# EAGLE design display300 (EAGLE 4.15)
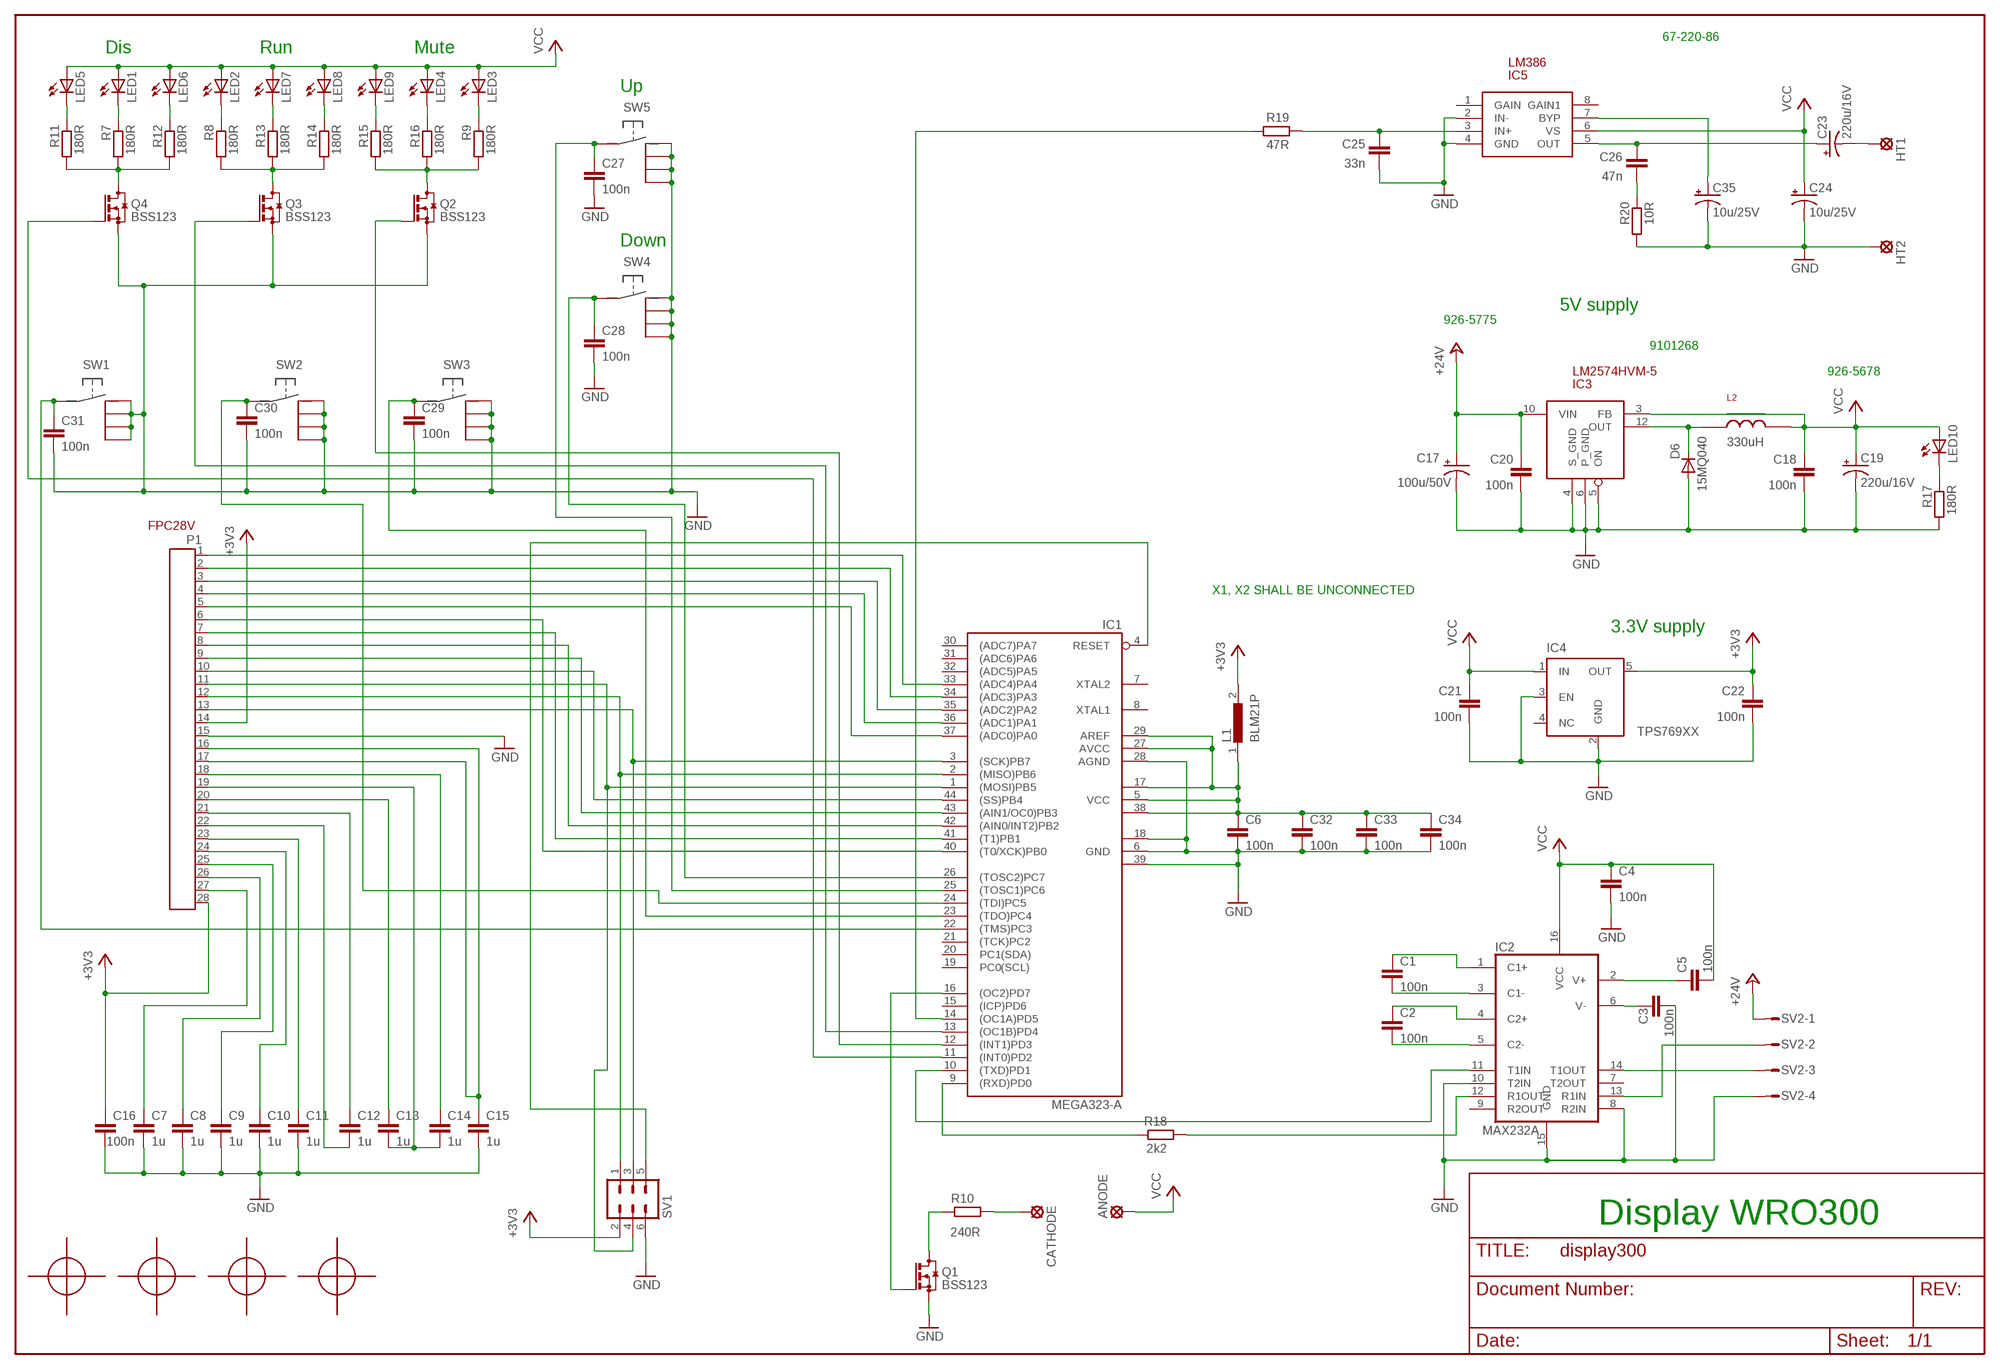
[diagram p0: schematic, sheet 1]

## Parts
ANODE  LSP13  [LSP13]
C1  100n  C-EUC0805K  [C0805K]
C2  100n  C-EUC0805K  [C0805K]
C3  100n  C-EUC0805K  [C0805K]
C4  100n  C-EUC0805K  [C0805K]
C5  100n  C-EUC0805K  [C0805K]
C6  100n  C-EUC0805K  [C0805K]
C7  1u  C-EUC0805K  [C0805K]
C8  1u  C-EUC0805K  [C0805K]
C9  1u  C-EUC0805K  [C0805K]
C10  1u  C-EUC0805K  [C0805K]
C11  1u  C-EUC0805K  [C0805K]
C12  1u  C-EUC0805K  [C0805K]
C13  1u  C-EUC0805K  [C0805K]
C14  1u  C-EUC0805K  [C0805K]
C15  1u  C-EUC0805K  [C0805K]
C16  100n  C-EUC0805K  [C0805K]
C17  100u/50V  CPOL-USE  [PANASONIC_E]
C18  100n  C-EUC0805K  [C0805K]
C19  220u/16V  CPOL-USD  [PANASONIC_D]
C20  100n  C-EUC0805K  [C0805K]
C21  100n  C-EUC0805K  [C0805K]
C22  100n  C-EUC0805K  [C0805K]
C23  220u/16V  CPOL-USD  [PANASONIC_D]
C24  10u/25V  CPOL-USB  [PANASONIC_B]
C25  33n  C-EUC0805K  [C0805K]
C26  47n  C-EUC0805K  [C0805K]
C27  100n  C-EUC0805K  [C0805K]
C28  100n  C-EUC0805K  [C0805K]
C29  100n  C-EUC0805K  [C0805K]
C30  100n  C-EUC0805K  [C0805K]
C31  100n  C-EUC0805K  [C0805K]
C32  100n  C-EUC0805K  [C0805K]
C33  100n  C-EUC0805K  [C0805K]
C34  100n  C-EUC0805K  [C0805K]
C35  10u/25V  CPOL-USB  [PANASONIC_B]
CATHODE  LSP13  [LSP13]
D6  15MQ040  DIODE-SMB  [SMB]
HT1  LSP10  [LSP10]
HT2  LSP10  [LSP10]
IC1  MEGA323-A  [TQFP44]
IC2  MAX232A  [SO16]
IC3  LM2574HVM-5  [SO14W]
IC4  TPS769XX  [SOT23-5]
IC5  LM386  [SO8]
L1  BLM21P  L1210  [C1210]
L2  330uH  IND_KOA_330U  [IND_KOA_330U]
LED1  LEDSMT1206  [1206]
LED2  LEDSMT1206  [1206]
LED3  LEDSMT1206  [1206]
LED4  LEDSMT1206  [1206]
LED5  LEDSMT1206  [1206]
LED6  LEDSMT1206  [1206]
LED7  LEDSMT1206  [1206]
LED8  LEDSMT1206  [1206]
LED9  LEDSMT1206  [1206]
LED10  LEDSMT1206  [1206]
P1  FPC28V  [FPC28V]
Q1  BSS123  [SOT23]
Q2  BSS123  [SOT23]
Q3  BSS123  [SOT23]
Q4  BSS123  [SOT23]
R7  180R  R-EU_M0805  [M0805]
R8  180R  R-EU_M0805  [M0805]
R9  180R  R-EU_M0805  [M0805]
R10  240R  R-EU_M0805  [M0805]
R11  180R  R-EU_M0805  [M0805]
R12  180R  R-EU_M0805  [M0805]
R13  180R  R-EU_M0805  [M0805]
R14  180R  R-EU_M0805  [M0805]
R15  180R  R-EU_M0805  [M0805]
R16  180R  R-EU_M0805  [M0805]
R17  180R  R-EU_M0805  [M0805]
R18  2k2  R-EU_M0805  [M0805]
R19  47R  R-EU_M0805  [M0805]
R20  10R  R-EU_R0805W  [R0805W]
SV1  MA03-2  [MA03-2]
SV2  S04P  [S04P]
SW1  GPV_PUSH  [GPV_PUSH]
SW2  GPV_PUSH  [GPV_PUSH]
SW3  GPV_PUSH  [GPV_PUSH]
SW4  GPV_PUSH  [GPV_PUSH]
SW5  GPV_PUSH  [GPV_PUSH]
U$1  FEDUSIAL_1MM  [FEDUSIAL_1MM]
U$2  FEDUSIAL_1MM  [FEDUSIAL_1MM]
U$3  FEDUSIAL_1MM  [FEDUSIAL_1MM]
U$4  FEDUSIAL_1MM  [FEDUSIAL_1MM]

## Nets
+3V3: C16.1 C22.2 IC4.5(OUT) L1.2 P1.14 P1.28 SV1.2
+24V: C17.+ C20.2 IC3.10(VIN) SV2.1
GND: C3.2 C4.2 C6.2 C7.2 C8.2 C9.2 C10.2 C11.2 C15.2 C16.2 C17.- C18.1 C19.- C20.1 C21.1 C22.1 C24.- C25.1 C27.2 C28.2 C29.2 C30.2 C31.2 C32.2 C33.2 C34.2 C35.- D6.A HT2.MP IC1.6(GND) IC1.18(GND1) IC1.28(AGND) IC1.39(GND2) IC2.8(R2IN) IC2.10(T2IN) IC2.15(GND) IC3.4(S_GND) IC3.5(ON) IC3.6(P_GND) IC4.2(GND) IC4.3(EN) IC5.2(IN-) IC5.4(GND) P1.15 Q1.2(S) Q2.2(S) Q3.2(S) Q4.2(S) R17.2 R20.2 SV1.6 SV2.4 SW1.P$2 SW1.P$3 SW1.P$4 SW1.P$5 SW2.P$2 SW2.P$3 SW2.P$4 SW2.P$5 SW3.P$2 SW3.P$3 SW3.P$4 SW3.P$5 SW4.P$2 SW4.P$3 SW4.P$4 SW4.P$5 SW5.P$2 SW5.P$3 SW5.P$4 SW5.P$5
N$1: IC1.40((T0/XCK)PB0) P1.6
N$2: IC1.41((T1)PB1) P1.7
N$3: IC1.42((AIN0/INT2)PB2) P1.8
N$4: IC1.43((AIN1/OC0)PB3) P1.9
N$5: IC1.44((SS)PB4) P1.10
N$6: IC1.1((MOSI)PB5) P1.11 SV1.4
N$7: IC1.2((MISO)PB6) P1.12 SV1.1
N$8: IC1.3((SCK)PB7) P1.13 SV1.3
N$9: IC1.37((ADC0)PA0) P1.5
N$10: IC1.36((ADC1)PA1) P1.4
N$11: IC1.35((ADC2)PA2) P1.3
N$12: IC1.34((ADC3)PA3) P1.2
N$13: IC1.33((ADC4)PA4) P1.1
N$14: C15.1 P1.16 P1.17
N$15: C27.1 IC1.25((TOSC1)PC6) SW5.P$1
N$16: C14.1 P1.18
N$17: C13.2 C14.2 P1.19
N$18: C13.1 P1.20
N$19: C12.1 P1.21
N$20: C12.2 P1.22
N$21: C11.1 P1.23
N$22: C10.1 P1.24
N$23: C9.1 P1.25
N$24: C8.1 P1.26
N$25: C7.1 P1.27
N$26: C35.+ IC5.7(BYP)
N$27: LED3.C R9.1
N$28: C6.1 C32.1 C33.1 C34.1 IC1.5(VCC) IC1.17(VCC1) IC1.27(AVCC) IC1.29(AREF) IC1.38(VCC2) L1.1
N$29: LED2.C R8.1
N$30: LED1.C R7.1
N$31: IC2.14(T1OUT) SV2.3
N$32: IC1.11((INT0)PD2) Q4.1(G)
N$33: IC2.13(R1IN) SV2.2
N$34: IC1.10((TXD)PD1) IC2.11(T1IN)
N$35: IC1.9((RXD)PD0) R18.2
N$36: C2.2 IC2.5(C2-)
N$37: C2.1 IC2.4(C2+)
N$38: C1.2 IC2.3(C1-)
N$39: C1.1 IC2.1(C1+)
N$40: C5.1 IC2.2(V+)
N$41: C3.1 IC2.6(V-)
N$42: IC1.13((OC1B)PD4) Q3.1(G)
N$43: IC1.4(RESET) SV1.5
N$44: IC1.12((INT1)PD3) Q2.1(G)
N$45: LED5.C R11.1
N$46: Q1.3(D) R10.2
N$47: LED6.C R12.1
N$48: LED7.C R13.1
N$49: Q4.3(D) R7.2 R11.2 R12.2
N$50: Q3.3(D) R8.2 R13.2 R14.2
N$51: CATHODE.MP R10.1
N$52: D6.C IC3.12(OUT) L2.P$1
N$53: Q2.3(D) R9.2 R15.2 R16.2
N$54: IC1.16((OC2)PD7) Q1.1(G)
N$55: LED10.C R17.1
N$56: LED8.C R14.1
N$57: LED9.C R15.1
N$58: LED4.C R16.1
N$59: IC2.12(R1OUT) R18.1
N$60: C23.+ C26.2 IC5.5(OUT)
N$61: C26.1 R20.1
N$63: C23.- HT1.MP
N$64: C25.2 IC5.3(IN+) R19.1
N$65: IC1.14((OC1A)PD5) R19.2
N$68: C28.1 IC1.26((TOSC2)PC7) SW4.P$1
N$71: C31.1 IC1.22((TMS)PC3) SW1.P$1
N$72: C30.1 IC1.24((TDI)PC5) SW2.P$1
N$73: C29.1 IC1.23((TDO)PC4) SW3.P$1
VCC: ANODE.MP C4.1 C5.2 C18.2 C19.+ C21.2 C24.+ IC2.16(VCC) IC3.3(FB) IC4.1(IN) IC5.6(VS) L2.P$4 LED1.A LED2.A LED3.A LED4.A LED5.A LED6.A LED7.A LED8.A LED9.A LED10.A
Unconnected: IC1.7(XTAL2) IC1.8(XTAL1) IC1.15((ICP)PD6) IC1.19(PC0(SCL)) IC1.20(PC1(SDA)) IC1.21((TCK)PC2) IC1.30((ADC7)PA7) IC1.31((ADC6)PA6) IC1.32((ADC5)PA5) IC2.7(T2OUT) IC2.9(R2OUT) IC4.4(NC) IC5.1(GAIN) IC5.8(GAIN1)

## Notes on the sheet
- 67-220-86
- Dis | Run | Mute
- Up
- Down
- 5V supply
- 926-5775
- 9101268
- 926-5678
- X1, X2 SHALL BE UNCONNECTED
- 3.3V supply
- Display WRO300

## Library data of the parts
ANODE CATHODE = solpad:LSP13: SOLDER PAD drill 1.3 mm, distributor Buerklin, 12H562
C1-C16 C18 C20-C22 C25-C34 = rcl:C-EU: CAPACITOR, European symbol
C17 C19 C23 C24 C35 = rcl:CPOL-US: POLARIZED CAPACITOR, American symbol
D6 = diode:DIODE-: DIODE
HT1 HT2 = solpad:LSP10: SOLDER PAD drill 1.0 mm, distributor Buerklin, 12H555
IC1 = avr:MEGA323: MICROCONTROLLER 32 Kbytes FLASH 2 Kbytes SRAM 1 Kbytes EEPROM USART 8-channel 10 bit ADC
IC2 = lbm:MAX232A
IC3 = lbm:LM2574
IC4 = lbm:TPS769XX
IC5 = lbm:LM386
L1 = lbm:L1210
L2 = lbm:IND_KOA_330U
LED1-LED10 = led:LED: LED OSRAM: - CHIPLED LG R971, LG N971, LY N971, LG Q971, LY Q971, LO R971, LY R971 LH N974, LH R974 LS Q976, LO Q976, LY Q976 LO Q996 - Hyper CHIPLED LW Q18S LB Q993, LB Q99A, LB R99A - SideLED LS A670, LO A670, LY A670, LG A670, LP A670 LB A673, LV A673, LT A673, LW A673 LH A674 LY A675 LS A676, LA A676, LO A676, LY A676, LW A676 LS A679, LY A679, LG A679 - Hyper Micro SIDELED® LS Y876, LA Y876, LO Y876, LY Y876 LT Y87S - SmartLED LW L88C, LW L88S LB L89C, LB L89S, LG L890 LS L89K, LO L89K, LY L89K LS L896, LA L896, LO L896, LY L896 - TOPLED LS T670, LO T670, LY T670, LG T670, LP T670 LSG T670, LSP T670, LSY T670, LOP T670, LYG T670 LG T671, LOG T671, LSG T671 LB T673, LV T673, LT T673, LW T673 LH T674 LS T676, LA T676, LO T676, LY T676, LB T676, LH T676, LSB T676, LW T676 LB T67C, LV T67C, LT T67C, LS T67K, LO T67K, LY T67K, LW E67C LS E67B, LA E67B, LO E67B, LY E67B, LB E67C, LV E67C, LT E67C LW T67C LS T679, LY T679, LG T679 LS T770, LO T770, LY T770, LG T770, LP T770 LB T773, LV T773, LT T773, LW T773 LH T774 LS E675, LA E675, LY E675, LS T675 LS T776, LA T776, LO T776, LY T776, LB T776 LHGB T686 LT T68C, LB T68C - Hyper Mini TOPLED® LB M676 - Mini TOPLED Santana® LG M470 LS M47K, LO M47K, LY M47K Source: http://www.osram.convergy.de/
P1 = lbm:FPC28V
Q1-Q4 = transistor-small-signal:BSS123: N-CHANNEL MOS FET
R7-R20 = rcl:R-EU_: RESISTOR, European symbol
SV1 = con-lstb:MA03-2: PIN HEADER
SV2 = con-amp-mt:S04P: AMP MT CONNECTOR
SW1-SW5 = lbm:GPV_PUSH
U$1-U$4 = lbm:FEDUSIAL_1MM

## Board
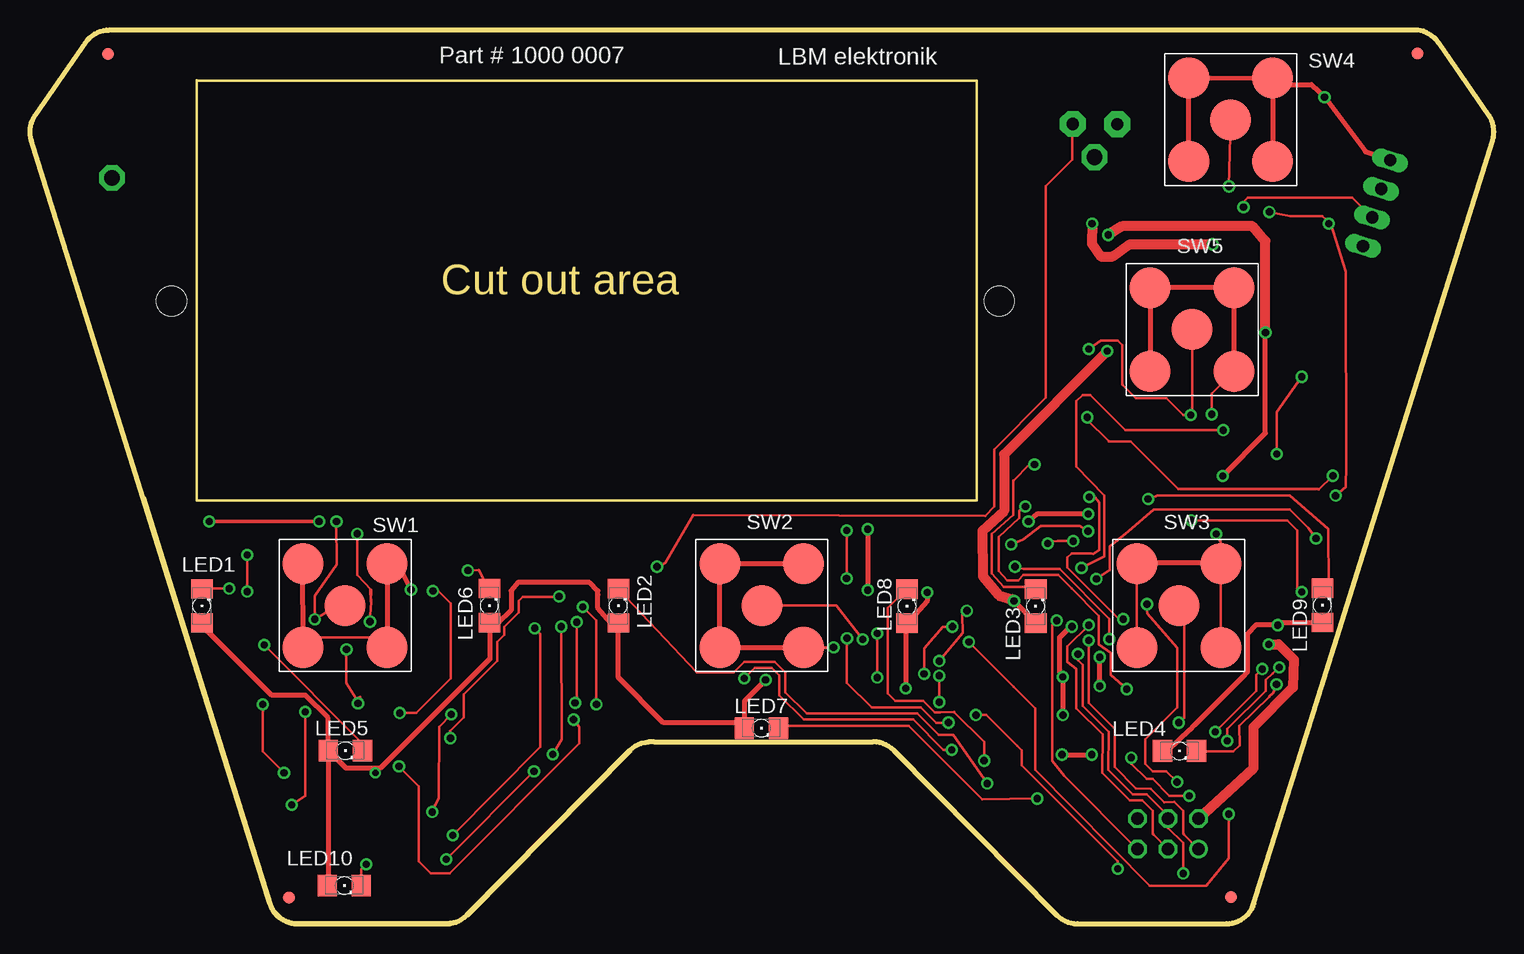
[diagram p1: board, top side]
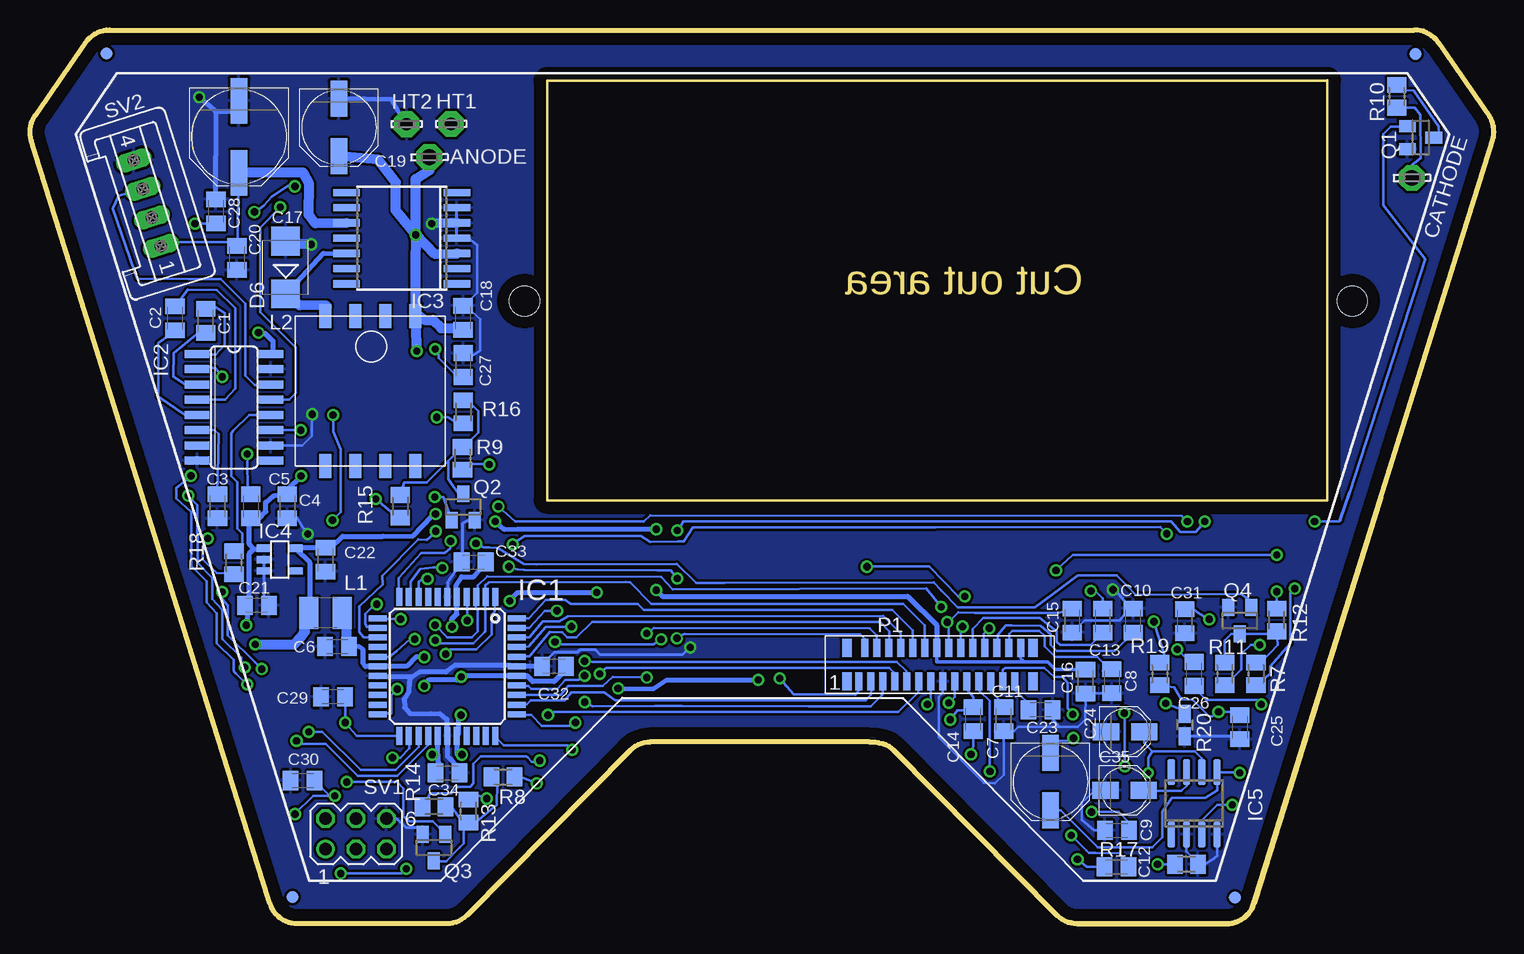
[diagram p2: board, bottom side, seen from below]

Size 121.99 x 74.52 mm. Coordinates in mm from the lower left corner, seen from the top.
Outline: 115.37,74.51 115.63,74.5 115.88,74.46 116.13,74.39 116.37,74.3 116.6,74.18 116.81,74.03 117.01,73.87 117.19,73.68 117.34,73.48 121.56,67.39 121.69,67.18 121.8,66.97 121.88,66.74 121.94,66.5 121.98,66.26 121.99,66.02 121.98,65.78 121.94,65.54 121.88,65.31 102,1.68 101.91,1.45 101.79,1.22 101.66,1.01 101.5,0.81 101.32,0.63 101.12,0.47 100.91,0.33 100.69,0.21 100.45,0.12 100.21,0.05 99.96,0.01 99.7,0 87.28,0 87.01,0.01 86.74,0.06 86.48,0.14 86.23,0.24 85.99,0.37 85.77,0.53 85.57,0.71 71.98,14.46 71.78,14.64 71.56,14.8 71.32,14.93 71.07,15.03 70.81,15.11 70.55,15.15 70.27,15.17 52.03,15.15 51.55,15.14 51.28,15.1 50.91,15.03 50.66,14.93 50.42,14.8 50.2,14.64 50,14.46 36.41,0.71 36.21,0.53 35.99,0.37 35.75,0.24 35.5,0.14 35.24,0.06 34.97,0.01 34.7,0 22.28,0 22.02,0.01 21.77,0.05 21.53,0.12 21.29,0.21 21.07,0.33 20.86,0.47 20.66,0.63 20.48,0.81 20.32,1.01 20.19,1.22 20.08,1.45 19.99,1.68 9.43,35.52
Outline: 115.66,74.51 6.62,74.52 6.36,74.5 6.11,74.46 5.86,74.39 5.62,74.3 5.39,74.18 5.18,74.04 4.98,73.87 4.8,73.69 4.65,73.48 0.43,67.39 0.3,67.19 0.19,66.97 0.11,66.74 0.05,66.5 0.01,66.27 0,66.03 0.01,65.78 0.05,65.54 0.11,65.31 19.99,1.69 20.08,1.45 20.2,1.22 20.33,1.01 20.49,0.81 20.67,0.63 20.87,0.47 21.08,0.33 21.3,0.21 21.54,0.12 21.78,0.06 22.03,0.01 22.29,0 34.71,0 34.98,0.02 35.25,0.06 35.51,0.14 35.76,0.24 36,0.38 36.22,0.53 36.42,0.72 50.01,14.46
Outline: 13.88,70.29 78.9,70.29 78.9,35.31 13.88,35.31 13.88,70.31
Copper layers (1*16): Top 0.035mm / dielectric 1.5mm / Bottom 0.035mm
Design rules "default": minimum track width 8mil, minimum drill 20mil, track to track 8mil, track to pad 8mil, pad to pad 7mil, via to via 8mil, smd to smd 8mil, copper to edge 40mil, drill to drill 8mil, minimum pad ring 10mil, minimum via ring 8mil, stop-mask expansion 4mil, vias tented up to drill 0mil, thermal gap 10mil
Holes 2.5 mm at 80.78,51.92 11.79,51.92

### Footprints (pad centres in the part's own frame; a part is rotated, then mirrored left to right if it is on the bottom)
LSP13 = drill 1.321 pad 2.159 octagon: MP 0,0
C0805K = smd 1.3 x 1.6: 1 -1,0; 2 1,0
PANASONIC_E = smd 3.8 x 1.4: + 3,0; - -3,0
PANASONIC_D = smd 3 x 1.4: + 2.4,0; - -2.4,0
PANASONIC_B = smd 2.2 x 1.4: + 1.6,0; - -1.6,0
SMB = smd 2.4 x 2.4: A 2.2,0; C -2.2,0
LSP10 = drill 1.016 pad 2.159 octagon: MP 0,0
TQFP44 = smd 1.5 x 0.5: 1 -5.8,4; 2 -5.8,3.2; 3 -5.8,2.4; 4 -5.8,1.6; 5 -5.8,0.8; 6 -5.8,0; 7 -5.8,-0.8; 8 -5.8,-1.6; 9 -5.8,-2.4; 10 -5.8,-3.2; 11 -5.8,-4; 23 5.8,-4; 24 5.8,-3.2; 25 5.8,-2.4; 26 5.8,-1.6; 27 5.8,-0.8; 28 5.8,0; 29 5.8,0.8; 30 5.8,1.6; 31 5.8,2.4; 32 5.8,3.2; 33 5.8,4 | smd 0.5 x 1.5: 12 -4,-5.8; 13 -3.2,-5.8; 14 -2.4,-5.8; 15 -1.6,-5.8; 16 -0.8,-5.8; 17 0,-5.8; 18 0.8,-5.8; 19 1.6,-5.8; 20 2.4,-5.8; 21 3.2,-5.8; 22 4,-5.8; 34 4,5.8; 35 3.2,5.8; 36 2.4,5.8; 37 1.6,5.8; 38 0.8,5.8; 39 0,5.8; 40 -0.8,5.8; 41 -1.6,5.8; 42 -2.4,5.8; 43 -3.2,5.8; 44 -4,5.8
SO16 = smd 0.66 x 2.032: 1 -4.445,-3.073; 2 -3.175,-3.073; 3 -1.905,-3.073; 4 -0.635,-3.073; 5 0.635,-3.073; 6 1.905,-3.073; 7 3.175,-3.073; 8 4.445,-3.073; 9 4.445,3.073; 10 3.175,3.073; 11 1.905,3.073; 12 0.635,3.073; 13 -0.635,3.073; 14 -1.905,3.073; 15 -3.175,3.073; 16 -4.445,3.073
SO14W = smd 0.6 x 2.2: 1 -3.81,-4.6; 2 -2.54,-4.6; 3 -1.27,-4.6; 4 0,-4.6; 5 1.27,-4.6; 6 2.54,-4.6; 7 3.81,-4.6; 8 3.81,4.6; 9 2.54,4.6; 10 1.27,4.6; 11 0,4.6; 12 -1.27,4.6; 13 -2.54,4.6; 14 -3.81,4.6
SOT23-5 = smd 0.6 x 1.2: 1 -0.95,-1.306; 2 0,-1.306; 3 0.95,-1.306; 4 0.95,1.306; 5 -0.95,1.306
SO8 = smd 0.6 x 2.2: 1 -1.905,-2.6; 2 -0.635,-2.6; 3 0.635,-2.6; 4 1.905,-2.6; 5 1.905,2.6; 6 0.635,2.6; 7 -0.635,2.6; 8 -1.905,2.6
C1210 = smd 1.6 x 2.7: 1 -2.67,2.54; 2 0.13,2.54
IND_KOA_330U = smd 2 x 1: P$1 0,0; P$2 0,2.5; P$3 0,5; P$4 0,7.5; P$5 12.5,0; P$6 12.5,2.5; P$7 12.5,5; P$8 12.5,7.5
1206 = smd 1.6 x 1.803: A -1.422,0; C 1.422,0
FPC28V = smd 0.6 x 1.5: 1 0,0; 2 0.5,2.8; 3 1,0; 4 1.5,2.8; 5 2,0; 6 2.5,2.8; 7 3,0; 8 3.5,2.8; 9 4,0; 10 4.5,2.8; 11 5,0; 12 5.5,2.8; 13 6,0; 14 6.5,2.8; 15 7,0; 16 7.5,2.8; 17 8,0; 18 8.5,2.8; 19 9,0; 20 9.5,2.8; 21 10,0; 22 10.5,2.8; 23 11,0; 24 11.5,2.8; 25 12,0; 26 12.5,2.8; 27 13,0; 28 13.5,2.8 | smd 0.8 x 1.5: 29 -1,0; 30 -1,2.8; 31 14.5,2.8; 32 14.5,0
SOT23 = smd 1 x 1.4: 1 -0.95,-1.1; 2 0.95,-1.1; 3 0,1.1
M0805 = smd 1.3 x 1.6: 1 -0.95,0; 2 0.95,0
R0805W = smd 1.5 x 1: 1 -0.94,0; 2 0.94,0
MA03-2 = drill 1.016 round: 1 -2.54,-1.27 | drill 1.016 octagon: 2 -2.54,1.27; 3 0,-1.27; 4 0,1.27; 5 2.54,-1.27; 6 2.54,1.27
S04P = drill 1.016 long: 1 3.75,0; 2 1.25,0; 3 -1.25,0; 4 -3.75,0
GPV_PUSH = smd 3.4 x 3.4: P$1 0,0; P$2 -3.493,3.493; P$3 3.493,3.493; P$4 3.493,-3.493; P$5 -3.493,-3.493
FEDUSIAL_1MM = smd 1 x 1: P$1 0,0 | smd 1 x 1 bottom: P$2 0,0

### Placement (x,y rotation side)
ANODE  88.71,63.9 0 bottom
C1  107.35,50.25 270 bottom
C2  109.9,50.47 270 bottom
C3  106.37,34.8 270 bottom
C4  100.54,34.8 270 bottom
C5  103.59,34.8 270 bottom
C6  96.39,23.11 180 bottom
C7  37.77,17.83 0 bottom
C8  31.84,20.21 270 bottom
C9  31.42,7.78 180 bottom
C10  30.06,25.27 90 bottom
C11  40.85,17.04 270 bottom
C12  31.45,4.74 0 bottom
C13  32.6,25.27 90 bottom
C14  43.39,17.06 90 bottom
C15  35.14,25.27 270 bottom
C16  34.03,20.19 270 bottom
C17  104.58,65.61 270 bottom
C18  85.91,50.52 270 bottom
C19  96.25,66.38 270 bottom
C20  104.75,55.51 90 bottom
C21  103.08,26.54 180 bottom
C22  97.37,30.35 90 bottom
C23  36.95,11.83 270 bottom
C24  30.73,16 0 bottom
C25  21.17,16.38 90 bottom
C26  24.98,20.83 270 bottom
C27  85.89,46.57 90 bottom
C28  106.5,59.39 90 bottom
C29  96.73,18.92 180 bottom
C30  99.27,11.94 180 bottom
C31  25.77,25.22 270 bottom
C32  78.32,21.46 180 bottom
C33  85.01,30.16 180 bottom
C34  87.21,12.57 0 bottom
C35  30.77,11.12 0 bottom
CATHODE  6.83,62.19 0 bottom
D6  100.7,54.71 90 bottom
HT1  86.91,66.69 0 bottom
HT2  90.61,66.67 0 bottom
IC1  87.21,21.46 270 bottom
IC2  104.99,43.05 270 bottom
IC3  91.02,57.15 90 bottom
IC4  101.18,30.35 270 bottom
IC5  24.98,10.03 0 bottom
L1  98.64,28.45 180 bottom
L2  97.37,50.67 270 bottom
LED1  14.32,26.5 90 top
LED2  49.03,26.51 90 top
LED3  83.81,26.47 90 top
LED4  95.79,14.41 0 top
LED5  26.28,14.43 0 top
LED6  38.29,26.52 90 top
LED7  60.95,16.32 0 top
LED8  73.09,26.47 90 top
LED9  107.71,26.55 90 top
LED10  26.19,3.19 0 top
P1  52.92,20.19 0 bottom
Q1  6.11,65.53 270 bottom
Q2  85.89,34.75 0 bottom
Q3  88.33,6.35 180 bottom
Q4  21.17,25.27 180 bottom
R7  19.82,20.83 90 bottom
R8  82.57,12.25 180 bottom
R9  85.95,38.8 90 bottom
R10  8.09,68.99 90 bottom
R11  22.44,20.83 90 bottom
R12  18.09,25.32 270 bottom
R13  85.46,9.4 270 bottom
R14  88.33,9.75 0 bottom
R15  91.14,34.8 90 bottom
R16  85.88,42.68 90 bottom
R17  25.61,4.95 0 bottom
R18  104.99,30.1 270 bottom
R19  27.85,20.83 90 bottom
R20  25.75,16.57 270 bottom
SV1  94.83,7.49 0 bottom
SV2  112.22,60.08 287.5 bottom
SW1  26.25,26.53 0 top
SW2  60.98,26.53 0 top
SW3  95.74,26.52 0 top
SW4  100.05,67.03 0 top
SW5  96.84,49.54 0 top
U$1  6.52,72.53 0 top
U$2  115.61,72.56 0 top
U$3  21.58,2.18 0 top
U$4  100.1,2.21 0 top

### Tracks (layer width: path | path; a pad name or v marks a point on that pad's centre or on a via)
+3V3  (via drill 0.6)
  Top 0.406: v69.81,32.89 v69.81,27.81 | v83.21,33.53 83.92,34.15 v88.19,34.15
  Top 0.813: SV1.2 101.94,12.95 101.94,16.38 105.24,19.69 105.32,22.02 104.05,23.29 v103.23,23.29
  Bottom 0.203: P1.14 46.44,22.99 46.44,22.48
  Bottom 0.254: 39.18,21.84 39.18,21.9 39.42,22.14 P1.28
  Bottom 0.305: 46.44,22.48 46.42,21.83 46.41,21.84 39.18,21.84 37.17,21.84 36.53,21.21 35.14,21.21 C16.1
  Bottom 0.406: P1.14 46.44,23.02 46.44,24.89 48.85,27.31 69.3,27.31 v69.81,27.81 | 97.37,31.37 C22.2 | 97.37,31.37 99.81,31.37 IC4.5 98.64,30.07 98.64,26.42 98.76,26.29 L1.2 | 97.37,31.37 97.11,31.62 | v69.81,32.89 80.54,32.89 81.38,32.9 82.46,32.89 v83.21,33.53 | C22.2 97.37,31.24 | v88.19,34.15 88.52,33.95 90.07,32.34 92.58,32.3 95.97,32.3 96.96,31.31 97,31.35 C22.2
  Bottom 0.813: L1.2 99.13,24.32 99.07,24.35 | v103.23,23.29 99.99,23.27 99.35,23.98 99.07,24.35 | 99.07,24.35 99.15,24.33
+24V
  Bottom 0.203: C17.+ 104.67,58.59 104.67,56.65 | 104.88,56.81 110.1,56.81
  Bottom 0.254: 104.88,56.81 104.88,56.64 C20.2 | 110.1,56.81 110.17,56.74
  Bottom 0.406: 104.67,56.65 C20.2 | SV2.1 111.11,56.44 110.17,56.74
  Bottom 0.813: C17.+ 99.24,62.63 98.73,61.7 98.76,59.12 98.21,58.38 IC3.10
GND  (via drill 0.6)
  Top 0.203: v31.75,27.85 31.84,27.95 | SW4.P$3 103.63,70.32 104.93,69.97 | 107.96,68.91 107.88,68.69 | SW5.P$4 98.48,44.19 v98.48,42.47 | SW1.P$4 29.78,23.07 29.75,23.88 22.84,23.88 SW1.P$5
  Top 0.22: SW3.P$2 92.25,30.12 | 92.25,30.12 SW3.P$5 | 92.25,30.12 92.07,30.3 | v98.85,32.49 99.23,31.83 SW3.P$3 99.22,30.01 | 99.22,30.01 99.15,30.08 | SW3.P$4 99.23,30 99.22,30.01
  Top 0.254: SW2.P$4 66.1,23.04 v66.96,23.04
  Top 0.406: 57.49,29.97 | 64.47,30.23 64.48,30.22 SW2.P$3 57.54,30.02 57.49,29.97 | 29.8,28.96 29.75,29.27 SW1.P$3 29.8,30.08 | 29.8,30.08 29.8,30.1 | SW1.P$4 29.8,23.09 29.8,28.96 | 29.8,28.96 29.8,30.08 | SW3.P$2 92.33,30.1 99.27,30.1 99.27,30.05 SW3.P$3 | 103.1,63.24 103.66,63.2 103.55,63.14 SW4.P$3 103.65,70.5 | 103.1,63.24 SW4.P$4 | SW5.P$2 93.36,53.03 SW5.P$2 | SW5.P$2 SW5.P$5 | SW5.P$2 | SW5.P$2 93.3,53.09 | SW5.P$2 93.38,53.03 93.43,53.09 93.49,53.03 SW5.P$3 | 29.8,28.96 30.74,29.88 v31.75,27.85 | 57.49,29.97 SW2.P$2 | SW2.P$4 57.54,23.04 57.49,22.99 | 57.49,22.99 57.49,29.97 | SW2.P$5 57.49,22.99 | SW5.P$3 101.3,52.25 | 104.93,69.97 106.81,69.96 107.96,68.91 | 107.88,68.69 107.85,69.01 111.3,64.36 SV2.4 | 103.1,63.24 103.12,63.24 103.23,63.34 | 103.65,70.5 SW4.P$2 96.59,70.31 96.59,70.3 96.56,70.28 | 103.65,70.5 103.82,70.29 | 103.1,63.24 103.48,63.24 103.68,63.51 103.52,63.22 103.45,63.15 | 100.33,53.15 SW5.P$3 | SW5.P$4 100.33,53.15 | 100.33,53.15 100.32,53.16 | SW4.P$5 96.56,70.28 | 96.56,70.28 96.54,70.27 96.4,70.27 | SW1.P$2 22.72,30.1 SW1.P$5
  Top 0.813: v98.56,56.64 91.65,56.64 90.23,55.63 89.25,55.63 88.5,56.69 v88.51,58.37
  Bottom 0.203: 24.72,4.95 24.7,4.95 24.7,5.13 25.62,6.05 25.62,7.6 25.61,7.61 | 31.23,19.15 31.23,19.14 | 31.23,19.15 | 31.23,19.15 31.21,19.16 | 102.5,30.38 102.45,30.38 102.45,30.37 | IC5.4 23.06,6.04 23.06,5.66 23.45,5.37 23.98,5.03 24.68,4.99 R17.2 | 30.64,26.76 30.51,26.66 | P1.15 45.92,19.25 46.28,18.89 | C24.- 32.66,16.37 | 31.91,7.32 C9.2 33.3,7.78 34.34,8.64 34.34,10.11 33.28,11.07 31.9,11.65 C35.- | 36.22,16.42 34.66,16.41 34.04,17.04 C16.2 31.86,19.19 C8.2 31.84,19.12 31.82,19.15 31.23,19.15 | C7.2 36.99,17.32 36.22,16.42 | 36.22,16.42 39.63,16.41 40.01,16.03 C11.2 40.85,12.43 41.59,11.69 42.53,11.76 46.28,15.52 46.28,18.89 | C35.- 32.36,11.11 | C35.- | 35.16,24.21 35.16,24.28 34.1,25.28 31.19,25.29 30.74,25.87 30.07,26.2 30.06,26.21 C10.2 | 104.83,67.73 C17.- | C27.2 85.62,47.03 84.49,47.78 84.49,50.4 85.91,51.67 | 85.91,51.67 85.92,51.68 85.64,51.68 84.71,52.61 84.71,56.59 85.45,57.15 | 85.91,51.67 C18.1 | 85.45,57.15 | 25.61,7.61 25.58,7.64 | 25.61,7.61 IC5.2 | 46.28,18.89 46.28,18.9 | v98.48,42.47 98.5,42.45 98.5,40.67 99.3,39.87 IC2.10 | IC2.10 101.94,39.87 | IC2.10
  Bottom 0.22: v98.85,32.49 99.08,32.8 99.77,33.86 100.6,33.86 C4.2
  Bottom 0.254: 85.45,57.15 IC3.4 86.42,58.37 IC3.5 86.42,59.59 IC3.6 | Q2.2 85.07,33.88 85.91,33.39 85.91,30.98 86.19,30.7 C33.2 87.19,28.45 IC1.6 | v66.96,23.04 67.62,22.43 74.48,22.43 74.86,22.81 76.16,22.81 76.34,22.63 78.29,22.63 79,21.92 79.1,21.92 79.1,21.68 C32.2 | C21.1 102.08,26.57 102.48,26.57 IC4.3 IC4.2 102.48,30.38 102.5,30.38 | Q3.2 89.63,8.01 90.62,8 91.43,8.73 92.31,8.76 SV1.6 | C15.2 35.14,24.23 35.16,24.21 | 29.95,26.27 30.4,26.66 30.64,26.76 31.66,27.94 v31.75,27.85 | R20.2 21.18,15.63 C25.1 | R17.2 24.7,4.95 | IC2.10 101.84,39.85
  Bottom 0.406: 29.93,26.29 29.95,26.27 C10.2 | C32.2 IC1.39 81.43,21.44 82.01,21.44 82.02,21.43 81.83,21.41 81.95,21.53 86.59,21.54 87.33,20.98 89.53,20.98 90.13,20.6 90.26,20.6 | 93.07,20.6 93.15,20.6 | 93.07,20.6 IC1.18 | 90.26,20.6 93.07,20.6 | 90.26,20.6 90.38,20.17 90.41,19.33 90.81,18.72 90.76,18.03 90.33,17.53 88.58,17.5 87.84,17.53 87.26,17.04 87.26,15.71 IC1.28 | C34.2 86.21,12.89 87.21,13.94 IC1.28 | IC1.28 87.21,15.72 | 106.58,67.79 v107.88,68.91 | 104.83,67.73 106.49,67.73 106.58,67.79 | 106.58,67.79 106.63,67.82 106.46,67.7 C28.2 | C19.- 91.84,68.69 90.61,66.55 HT2.MP
  Bottom 0.813: D6.A 100.43,56.64 v98.56,56.64 | IC3.5 86.97,58.41 v88.51,58.37
  pour Bottom: 6.05,74.04 115.66,74.04 115.91,73.79 121.5,66.04 101.05,0.89 86.32,0.89 71.59,15.49 50.76,15.62 35.39,0.63 21.17,0.63 0.34,66.04
N$1
  Bottom 0.203: P1.6 50.38,22.99 50.38,24.38 51.14,25.15 75.14,25.15 76.46,23.88 77.2,23.88 77.65,24.3 78.69,24.31 80.3,22.36 80.38,22.28 81.39,22.28 IC1.40
N$2  (via drill 0.6)
  Top 0.203: v76.87,24.76 76.06,24.76 74.54,22.94 v74.51,20.83
  Bottom 0.203: 80.98,23.11 arc-45 81.2,23.02 81.24,22.99 81.25,23 arc-45 IC1.41 81.38,23.05 80.42,23.1 79.02,24.76 v76.87,24.76 | P1.7 50,20.27 50,20.95 50.38,21.34 63.59,21.34 63.69,21.34 73.98,21.34 74.51,20.95 v74.51,20.83
N$3
  Bottom 0.203: IC1.42 81.25,23.86 81.24,23.88 80.4,23.88 79.26,25.21 77.87,25.21 77.16,25.62 50.89,25.65 49.42,24.19 P1.8
N$4  (via drill 0.6)
  Top 0.203: v78.08,26.09 77.68,25.76 77.73,24.25 v75.78,21.9
  Bottom 0.203: 81.37,24.64 arc45 81.39,24.65 IC1.43 | 81.37,24.64 81.39,24.66 IC1.43 | 81.37,24.64 81.24,24.76 | P1.9 48.98,20.26 48.98,21.08 49.74,21.84 63.33,21.84 63.46,21.84 75.14,21.84 v75.78,21.9 | v78.08,26.09 79.09,26.09 80.37,24.66 81.44,24.66 | 81.44,24.66 IC1.43 | 81.44,24.66 81.45,24.65
N$5
  Bottom 0.203: IC1.44 80.49,25.44 80.43,25.46 79.01,26.98 77.4,26.98 76.94,26.66 71.33,26.67 70.82,26.16 50.12,26.16 48.42,24.46 P1.10
N$6  (via drill 0.6)
  Top 0.203: v87.33,22.48 87.33,21.97 87.72,21.59 87.71,18.16 89.9,16 89.87,12.83 91.91,10.79 93.05,10.79 94.83,9.02 SV1.4 94.83,8 96.1,6.73 v96.1,4.19 | v78.83,17.4 79.71,17.4 82.25,14.85 82.63,14.47 82.63,13.22 90.64,5.21 v90.64,4.57
  Bottom 0.203: 48.01,19.77 arc-45 47.92,19.99 P1.11 47.96,20.19 47.96,19.3 49.64,17.66 56.12,17.66 56.53,17.65 58.14,17.65 67.9,17.65 75.27,17.65 75.41,17.65 76.04,17.65 76.16,17.65 77.43,17.65 78.32,17.66 v78.83,17.4 | IC1.1 83.25,27.22 arc-45 83.27,27.18 83.27,26.03 83.52,25.78 83.52,24.13 84.79,22.86 86.95,22.86 v87.33,22.48 | v90.64,4.57 91.02,4.19 v96.1,4.19
N$7  (via drill 0.6)
  Top 0.203: SV1.1 96.19,7.4 arc-45 96.1,7.62 | v88.22,23.62 88.22,18.41 90.38,16.25 90.38,13.08 92.16,11.3 93.39,11.26 94.53,10.12 95.34,10.16 96.1,9.4 96.1,7.62 | 96.1,7.62
  Bottom 0.203: 88.48,23.88 v88.22,23.62 87.97,23.37 85.05,23.37 84.13,24.29 arc-45 84.03,24.52 84.03,27.2 arc45 IC1.2 84.03,27.29 84.03,28.19 83.78,28.45 72.35,28.5 71.97,28.45 70.23,26.67 49.23,26.67 47.42,24.85 P1.12
N$8  (via drill 0.6)
  Top 0.203: SV1.3 93.65,7.4 arc-45 93.56,7.62 93.56,9.4 92.67,10.29 91.65,10.29 89.37,12.57 89.38,15.77 87.19,17.97 87.19,18.6 87.19,19.11 87.19,21.24 86.45,21.84 86.45,23.13 88.26,24.93 v88.23,24.9 | v47.2,18.29 47.2,25.27 v46.06,26.42
  Bottom 0.203: 84.79,27.18 arc45 84.81,27.21 IC1.3 | 84.79,27.18 84.83,27.14 84.83,26.32 84.67,26.16 84.67,24.38 85.18,23.88 87.21,23.88 v88.23,24.9 | P1.13 46.92,18.57 v47.2,18.29 | v46.06,26.42 47.31,27.94 68.45,27.89 69.39,28.91 83.91,28.96 84.67,28.19 84.67,27.31 84.79,27.18
N$9  (via drill 0.6)
  Top 0.203: v75.77,18.47 v75.78,20.68
  Bottom 0.203: P1.5 50.92,19.28 arc45 51.01,19.05 51.95,18.13 53.34,18.13 57.11,18.13 67.69,18.14 69.87,18.14 75.08,18.14 75.37,18.3 v75.77,18.47 | IC1.37 arc-45 81.28,19.81 80.48,19.81 80.22,19.56 78.04,19.56 77.4,20.32 76.29,20.32 v75.78,20.68
N$10  (via drill 0.6)
  Top 0.203: v70.6,24.21 v70.6,20.52
  Bottom 0.203: IC1.36 77.74,19.07 77.15,19.81 74.25,19.81 73.44,20.57 v70.6,20.52 | P1.4 51.42,24.03 52.03,24.64 70.01,24.66 70.47,24.23 v70.6,24.21
N$11
  Bottom 0.203: P1.3 51.9,19.32 arc45 51.94,19.09 52.36,18.62 54.92,18.62 56,18.62 68.38,18.63 70.05,18.63 73.21,18.63 74.13,19.3 76.9,19.3 77.43,18.63 80.25,18.63 80.6,18.28 81.43,18.28 | 81.51,18.16 IC1.35 81.43,18.28 | 81.43,18.28 81.49,18.28
N$12  (via drill 0.6)
  Top 0.203: v68.08,23.8 68.08,20.08 70.15,18.03 74.21,18.03 75.52,16.76 v76.54,16.76
  Bottom 0.203: IC1.34 81.34,17.4 80.22,17.4 79.33,16.51 76.79,16.51 v76.54,16.76 | P1.2 52.41,23.75 52.79,24.13 67.42,24.18 68.08,23.93 v68.08,23.8
N$13  (via drill 0.6)
  Top 0.203: v76.8,14.5 76.12,14.48 73.6,17.02 64.47,17.02 62.44,19.05 62.44,20.7 61.81,21.34 60.41,21.34 v59.52,20.45
  Bottom 0.203: 52.92,20.83 P1.1 52.92,19.56 arc45 53.22,19.1 53.23,19.1 55.27,19.1 58.35,19.12 v59.52,20.45 | 83.14,15.62 83.17,15.62 IC1.33 83.14,15.73 | v76.8,14.5 77.18,14.88 82.51,14.86 83.14,15.49 83.14,15.73 | 83.14,15.73 83.14,15.75
N$14  (via drill 0.6)
  Top 0.203: v45.42,18.41 45.55,18.54 v45.55,25.15
  Bottom 0.203: P1.16 45.42,24.65 45.42,24.64 45.42,25.15 | 45.42,25.15 44.63,25.93 43.26,25.93 42.38,25.93 36.27,25.93 35.14,26.29 C15.1 | P1.17 44.92,18.92 v45.42,18.41 | 45.42,25.15 v45.55,25.15
N$15  (via drill 0.6)
  Top 0.203: v98.76,16 102.19,19.43 102.19,20.75 v102.69,21.23 | 91.04,44.93 92.16,43.81 94.7,43.81 96.1,42.42 v96.73,42.42 96.86,42.54 96.86,49.56 | 91.04,44.93 91.02,44.96 | v88.23,47.92 89.22,48.63 90.65,48.63 91.02,48.26 91.02,44.96 91.05,44.93 91.04,44.93 | 96.86,49.56 96.86,49.66 | 96.86,49.56 SW5.P$1 | v105.98,27.67 105.59,27.84 105.59,32.8 104.77,33.62 v96.8,33.62 v96.78,33.64
  Bottom 0.203: IC1.25 89.61,14.75 91.53,12.83 94.45,12.83 97.62,16 v98.76,16 | v96.73,42.42 96.73,41.02 96.09,39.53 96.09,39.45 96.1,39.44 96.1,34.32 v96.78,33.64 | v102.69,21.23 103.05,21.6 103.23,21.8 105.51,24.02 105.5,24.04 105.5,26.54 106.01,27.11 v105.98,27.67 | 86.11,45.57 C27.1 85.9,45.59 86.36,45.59 87.92,47.15 87.92,47.46 v88.23,47.92
N$16  (via drill 0.6)
  Top 0.203: v44.28,24.76 44.3,15.36 v43.57,14.13
  Bottom 0.203: P1.18 44.42,24.63 v44.28,24.76 | v43.57,14.13 43.4,14.81 43.41,16.09 C14.1
N$17  (via drill 0.6)
  Top 0.203: v33.58,27.75 34.02,27.75 35.06,26.71 35.06,20.44 32.18,17.56 v30.81,17.56 | v30.75,13.12 32.38,11.46 32.38,5.2 33.39,4.19 34.98,4.19 45.76,15.03 45.76,16.4 45.77,16.41 v45.3,17.01
  Bottom 0.203: 32.6,26.29 C13.2 32.58,26.27 32.59,27.1 33.24,27.75 v33.58,27.75 | 43.9,20.01 44.01,20.12 44.1,20.12 44.05,20.17 43.96,20.17 43.96,20.4 43.98,20.38 43.98,20.26 P1.19 43.91,20.17 43.94,19.55 43.39,18.89 C14.2 43.34,18.01 43.34,17.96 43.14,18.28 44.09,17.79 44.71,17.79 v45.3,17.01 | v30.81,17.56 30.75,17.5 v30.75,13.12
N$18
  Bottom 0.203: P1.20 43.43,24.59 42.55,25.48 37.86,25.48 36.41,24.38 36.41,23.5 36.15,23.24 33.61,23.24 32.6,24.26 C13.1
N$19  (via drill 0.6)
  Top 0.203: v34.7,5.37 v42,12.7
  Bottom 0.203: 42.98,20.15 P1.21 42.85,20.25 42.85,19.36 42,18.58 v42,12.7 | C12.1 33.94,4.74 v34.7,5.37
N$20  (via drill 0.6)
  Top 0.203: v35.22,7.37 42.5,14.73
  Top 0.22: 42.05,24.63 42.03,24.65 | 42.05,24.63 v42.06,24.63 | 42.5,14.73 42.5,24.16 42.05,24.63
  Bottom 0.203: 42.38,22.99 | 42.38,22.99 P1.22 | 42.5,23.11 42.38,22.99 | C12.2 30.63,5.29 31.22,5.88 33.23,5.9 33.75,5.91 33.96,6.1 35.11,7.26 v35.22,7.37
  Bottom 0.22: 42.04,24.63 42.02,24.65 | v42.06,24.63 42.04,24.63 | 42.5,23.11 42.5,24.15 42.04,24.63
N$21
  Bottom 0.203: P1.23 41.92,19.35 40.85,18.29 C11.1
N$22
  Bottom 0.203: C10.1 30.06,24.26 31.58,22.73 36.41,22.73 36.92,23.24 36.92,24.13 37.74,24.84 40.18,24.85 40.66,24.85 41.36,24.08 41.36,24 41.36,22.99 P1.24
N$23  (via drill 0.6)
  Top 0.203: 34.08,10.48 34.09,16.42 v35.09,17.45 | 34.08,10.48 33.47,9.3 | 34.08,10.48 33.48,9.3 v33.53,9.31
  Bottom 0.203: P1.25 40.92,21.14 40.73,21.34 37.45,21.35 36.64,20.57 35.95,20.57 35.52,20.06 35.51,18.6 35.53,17.96 v35.09,17.45 | v33.53,9.31 31.28,9.31 30.37,8.4 30.37,7.9 30.48,7.79 30.46,7.78 C9.1
N$24
  Bottom 0.203: P1.26 40.39,23.82 40.4,23.55 40.4,24.16 40.13,24.41 37.9,24.41 37.42,24 37.42,23.11 36.53,22.22 33.07,22.25 32.06,21.24 C8.1 32.6,21.08
N$25
  Bottom 0.203: P1.27 39.92,19.51 38.31,17.91 C7.1
N$26
  Bottom 0.203: IC5.7 25.6,12.62 25.6,11.51 26.05,11.06 29.01,11.06 | 29.01,11.06 29.11,11.06 | 29.01,11.06 C35.+
N$27  (via drill 0.6)
  Top 0.203: LED3.C 83.52,28.08 81.13,28.08 80.16,29.19 80.15,32.48 81.94,34.08 81.94,36.93 81.97,36.94 83.29,38.27 v83.71,38.3
  Bottom 0.203: R9.1 86.16,38.33 84.21,38.31 v83.71,38.3
N$28  (via drill 0.6)
  Top 0.406: v86.08,17.4 86.06,17.53 v86.06,20.57 85.81,20.95 85.81,23.88 86.7,24.76 v86.83,24.76 | v89.15,19.81 v89.15,22.22 | v86,14.1 v88.48,14.1
  Bottom 0.203: 95.82,22.9 95.76,23.07 C6.1
  Bottom 0.406: 86.1,20.66 IC1.38 80.57,20.66 80.1,20.19 78.32,20.19 77.3,21.21 77.32,21.22 C32.1 | 86.1,20.66 86.19,20.66 86.19,20.7 v86.06,20.57 | v86.08,17.4 85.94,17.65 86.32,17.15 86.32,15.75 IC1.29 86.41,14.13 v86,14.1 | v86.83,24.76 86.83,25.4 86.41,25.82 IC1.5 86.45,27.3 86.47,28.26 86.03,28.92 85.03,28.92 C33.1 | v89.15,22.22 89.84,22.23 90.6,21.47 IC1.17 94.04,21.44 94.24,21.73 94.24,22.85 94.59,23.11 95.76,23.07 | 86.1,20.66 86.45,20.32 88.77,20.32 89.27,19.81 v89.15,19.81 | 88.01,14.1 88.01,13.5 87.77,13.21 87.84,12.95 88.22,12.57 C34.1 | 88.01,14.1 IC1.27 | v88.48,14.1 88.01,14.1
  Bottom 0.813: C6.1 95.61,22.74 95.6,24.81 arc45 95.75,25.49 L1.1
N$29  (via drill 0.6)
  Top 0.203: 48.98,27.81 49.03,27.86 LED2.C 48.98,27.94 55.56,20.95 58.63,20.95 59.52,21.84 62.06,21.84 62.95,20.95 62.95,19.3 64.73,17.53 73.95,17.53 75.74,15.74 76.76,15.74 | 76.76,15.74 76.81,15.74 | 76.76,15.74 76.76,15.73 76.95,15.73 v79.77,11.69
  Bottom 0.203: R8.1 81.5,12.4 v79.77,11.69
N$30  (via drill 0.6)
  Top 0.203: LED1.C 14.31,27.94 v16.6,27.94
  Bottom 0.203: R7.1 19.82,20.32 19.31,20.32 18.65,20.83 18.65,21.46 16.98,23.37 16.98,27.56 v16.6,27.94
N$31
  Bottom 0.203: 112.65,61.24 114.61,60.7 115.09,59.61 113.32,54.43 113.32,54.41 113.04,53.78 108.78,53.76 106.09,53.76 104.05,51.72 104.05,45.71 103.26,44.92 101.95,44.92 IC2.14
  Bottom 0.254: 112.58,61.25 SV2.3 112.65,61.24
N$32  (via drill 0.6)
  Top 0.203: v86.94,31.9 86.44,31.9 85.65,31.89 85.17,31.89 v84.82,31.71
  Bottom 0.203: 91.14,27.33 IC1.11 91.19,27.26 91.14,27.31 91.27,27.43 91.27,28.83 89.37,30.93 87.43,30.93 86.96,31.3 86.96,31.47 v86.94,31.9 | 20.21,26.93 20.28,26.42 20.26,26.42 Q4.1 | 83.71,31.36 83,31.34 80.83,30.01 79.81,29.95 68.11,29.98 66.48,28.41 64.83,28.41 64.12,28.42 46.7,28.45 46.06,27.79 44.68,26.38 43.69,26.38 38.25,26.37 36.83,27.4 | v84.82,31.71 84.17,31.36 83.71,31.36 | 83.71,31.36 83.72,31.36
  Bottom 0.22: 20.21,26.93 20.22,26.93 21.1,27.48 29.85,27.42 30.56,28.17 31.42,29.04 34.65,29.05 34.68,29.05 36.83,27.4
N$33  (via drill 0.6)
  Top 0.203: v101.13,59.73 101.13,60.18 101.47,60.52 110.17,60.52 111.8,58.89 SV2.2
  Bottom 0.203: IC2.13 100.39,43.69 99.85,44.23 99.85,48.03 102.81,50.99 102.81,58.05 v101.13,59.73
N$34  (via drill 0.6)
  Top 0.203: v87.62,29.67 89.53,30.62 89.54,32.03 89.54,35.72 87.21,38.1 87.21,43.56 87.72,44.07 88.35,44.07 91.27,41.15 v99.44,41.15
  Bottom 0.203: 101.94,41.15 IC2.11 v99.44,41.15 | 87.6,29.65 v87.62,29.67 v87.61,29.68 88.37,29.69 89.46,29.56 90.27,28.54 90.27,27.3 90.31,27.26 IC1.10
N$35  (via drill 0.6)
  Top 0.203: v107.17,32.11 106.54,32.98 105,34.52 93.64,34.52 91.51,32.72 91.31,32.55 89.98,31.43 89.98,29.48 v88.87,28.73
  Bottom 0.203: 104.99,29.46 R18.2 106.43,29.25 107.59,30.35 107.59,31.47 v107.17,32.11 | v88.87,28.73 88.86,28.81 89.19,28.83 89.6,28.48 IC1.9
N$36
  Bottom 0.203: C2.2 111.3,48.39 111.3,43.95 109.05,42.42 IC2.5 108.04,42.42
N$37
  Bottom 0.203: C2.1 108.84,52.86 106.41,52.83 104.89,51.32 104.89,45.65 104.88,44.62 105.73,43.71 107.19,43.7 107.29,43.78 107.37,43.7 108.08,43.7 | 108.08,43.7 108.39,43.7 | 108.08,43.7 IC2.4
N$38
  Bottom 0.203: C1.2 107.61,49 | IC2.3 108.04,44.96 | 108.97,44.9 110.04,45.62 110.02,47.56 107.9,49.31
  Bottom 0.254: IC2.3 108.12,44.9 108.97,44.9 | C1.2 107.34,49.27 107.34,49.31 107.9,49.31
N$39
  Bottom 0.203: C1.1 106.93,51.79 106.71,51.53 105.76,50.92 105.76,48.27 106.5,47.44 108.07,47.44 IC2.1
N$40  (via drill 0.6)
  Top 0.203: v103.9,39.17 103.9,42.67 v105.97,45.6
  Bottom 0.203: 107.7,46.21 IC2.2 | v105.97,45.6 106.57,46.35 106.84,46.34 106.91,46.44 107.7,46.21 | 107.7,46.21 107.59,46.19 | C5.1 103.97,36.18 103.86,36.39 103.87,38.39 103.86,38.75 v103.9,39.17
N$41
  Bottom 0.203: IC2.6 106.64,41.15 106.26,40.83 C3.1 106.26,35.69
N$42  (via drill 0.6)
  Top 0.203: v93.08,26.64 93.09,25.85 95.59,22.99 95.59,18.03 92.92,15.37 92.92,13.34 93.56,12.7 94.7,12.7 v95.59,11.81
  Bottom 0.203: 91.4,11.81 v95.59,11.81 | Q3.1 88.41,8.53 90.38,8.53 90.89,8.97 90.89,11.3 91.4,11.81 | 91.4,11.81 91.38,11.81 | IC1.13 93.11,24.76 93.94,24.76 94.07,25.02 94.07,25.85 93.29,26.57 v93.08,26.64
N$43  (via drill 0.6)
  Top 0.203: 86.2,12.32 86.16,12.35 | 86.2,12.32 SV1.5 | v85.56,25.27 85.18,24.89 85.18,20.34 | 86.2,12.32 85.17,13.57 85.17,20.34 | 85.17,20.34 85.18,20.34 | 85.18,20.34 85.18,20.32 | 85.17,20.34
  Bottom 0.203: IC1.4 arc45 85.56,27.14 v85.56,25.27
N$44  (via drill 0.6)
  Top 0.203: v88.26,35.58 88.73,35.57 89.12,35.11 89.12,31.89 89.12,31.17 88.6,30.84 88.43,30.85 86.82,30.85 86.45,30.54 86.45,29.69 90.75,25.39 v91.11,25.39
  Bottom 0.203: Q2.1 87.56,35.58 v88.26,35.58 | IC1.12 92.94,25.39 v91.11,25.39
N$45  (via drill 0.6)
  Top 0.203: LED5.C 27.7,15.05 v19.52,23.24
  Bottom 0.203: v19.52,23.24 20.28,23.24 21.04,22.48 21.04,21.21 22.44,19.81 R11.1
N$46
  Bottom 0.203: 4.58,65.96 4.58,66.45 6.66,69.47 7.78,69.49
  Bottom 0.254: Q1.3 4.58,65.96 | 7.78,69.49 R10.2
N$47  (via drill 0.6)
  Top 0.203: LED6.C 38.04,28.19 37.39,29.48 v36.49,29.47 | v18.09,27.69 v18.09,30.73
  Bottom 0.203: 18.09,26.31 R12.1 v18.09,27.69 | v18.09,30.73 35.1,30.76 v36.49,29.47
N$48  (via drill 0.6)
  Top 0.203: v83.93,10.44 79.37,10.38 73.24,16.51 62.69,16.51 arc45 62.47,16.42 LED7.C
  Bottom 0.203: R13.1 85.45,10.29 84.95,10.79 v83.93,10.44
N$49
  Bottom 0.203: R11.2 22.44,23.62 21.89,24.17 Q4.3 18.2,24.17 17.99,24.38 R12.2 17.99,23.24 19.39,21.77 R7.2
N$50
  Bottom 0.203: Q3.3 88.33,5.21 87.31,5.21 86.18,6.35 85.86,6.72 85.86,8.31 | R8.2 83.07,11.76 83.09,9.91 84.82,8.51 85.86,8.31 | R14.2 86.85,9.75 85.86,8.31 | 85.86,8.31 R13.2
N$51
  Bottom 0.203: R10.1 6.97,68.05 6.59,68.02 6.16,67.46 6.11,63.83 6.82,63.28 6.83,62.28 CATHODE.MP
N$52
  Bottom 0.406: IC3.12 97.53,55.9 100.69,52.45
  Bottom 0.813: L2.P$1 97.27,51.54 99.55,51.56 100.69,52.45 D6.C
N$53
  Bottom 0.203: R15.2 90.81,36.78 90.8,36.78 90.8,36.77 88.94,36.77 86.86,38.85 | 85.91,36.12 85.75,36.13 Q2.3 85.89,36.26 86.32,35.91 86.78,36.56 | 86.78,36.56 86.89,36.7 87.14,37.09 87.14,38.57 86.86,38.85 | R16.2 85.88,43.78 85.79,43.87 84.65,42.73 84.65,40.97 85.87,39.75 R9.2 85.96,39.75 86.86,38.85 | 86.78,36.56
N$54  (via drill 0.6)
  Top 0.203: v89.94,23.72 89.94,25.41 85.81,29.59 82.82,29.57 v82.08,29.76 | v68.06,32.8 v68.05,28.8
  Top 0.305: v14.94,33.53 v24.09,33.53
  Bottom 0.203: v82.08,29.76 81.35,29.53 80.81,29.48 69.74,29.47 68.9,29.46 68.61,29.44 v68.05,28.8 | 12.02,35.94 5.74,55.42 9.24,59.91 9.23,62.66 9.23,65.84 8.59,66.47 7.3,66.47 | IC1.16 92,22.26 91.91,22.35 91.43,22.75 90.34,23.7 v89.94,23.72 | v14.94,33.53 v14.95,33.53 14.95,33.54 12.9,33.54 12.79,33.66 | v68.06,32.8 67.76,33.18 67.55,33.52 26.88,33.53 26.12,32.66 24.85,32.66 v24.09,33.53
  Bottom 0.254: 12.79,33.66 12.02,35.94 | Q1.1 7.21,66.41 7.22,66.4 7.3,66.47
N$55  (via drill 0.6)
  Top 0.203: LED10.C 27.62,4.54 v28.03,4.95
  Bottom 0.203: v28.03,4.95 R17.1
N$56  (via drill 0.6)
  Top 0.203: v79.51,13.6 79.51,15.18 77.02,17.63 77.02,17.65 75.87,17.64 75.39,17.64 74.42,18.59 72.09,18.59 71.46,19.19 71.46,26.34 72.98,27.86 72.96,27.88 LED8.C
  Bottom 0.203: R14.1 88.66,10.87 86.9,10.87 86.34,11.43 85.3,11.43 85.05,11.68 85.05,13.34 84.44,13.97 80.73,13.97 80.64,13.97 80.53,13.87 80.17,13.51 79.51,13.51 | 79.51,13.51 79.5,13.5 | v79.51,13.6 79.51,13.51
N$57  (via drill 0.6)
  Top 0.203: LED9.C 108.21,28.09 108.19,32.93 104.96,35.7 94.48,35.7 93.96,35.7 v93.17,35.41
  Bottom 0.203: R15.1 91.35,33.86 v93.17,35.41
N$58  (via drill 0.6)
  Top 0.203: LED4.C 97.28,14.35 100.29,14.35 100.8,14.86 100.79,16.48 103.28,18.93 103.6,19.23 v103.88,19.95 | v108.58,37.35 107.38,36.22 107.38,36.25 95.7,36.25 91.74,40.21 89.9,40.21 89.88,40.19 89.88,40.23 88.07,42.04 88.1,42.07 v88.1,42.22
  Bottom 0.203: v108.58,37.35 109.2,36.84 109.81,36.32 109.81,35.43 108.53,34.34 108.53,29.82 107.26,28.55 107.27,26.8 106.44,25.87 106.44,23.44 106.41,23.4 106.41,23.37 105.02,21.98 105.02,21.06 104.93,20.94 104.83,20.86 103.91,19.95 v103.88,19.95 103.97,20.11 | R16.1 86.49,41.8 87.19,42.25 v88.1,42.22
N$59
  Bottom 0.203: IC2.12 103.72,42.42 105.03,41.1 105.22,40.85 105.22,37.32 104.71,36.81 104.71,32.94 104.3,32.54 104.29,32.47 104.29,31.52 104.71,31.1 104.94,31.1 R18.1
N$60  (via drill 0.6)
  Top 0.203: v19.39,18.29 19.39,14.35 v21.17,12.57
  Bottom 0.203: 21.42,12.63 21.11,12.63 | 21.42,12.63 IC5.5 23.07,12.61 23.07,12.6 23.07,11.12 24.07,10.48 26.84,10.48 27.65,9.34 27.65,7.21 28.46,6.38 33.03,6.37 36.1,9.43 C23.+ | C26.2 24.98,19.69 23.96,18.67 19.77,18.67 v19.39,18.29 | 21.42,12.63 21.42,12.57 v21.17,12.57
N$61  (via drill 0.6)
  Top 0.203: v26.37,22.86 26.37,20.07 27.2,18.73 | 27.2,18.73 27.39,18.41 | v27.33,18.36 27.52,18.92 27.2,18.73
  Bottom 0.203: C26.1 25.34,21.83 v26.37,22.86 | R20.1 25.6,17.72 27.05,18.25 v27.33,18.36
N$63  (via drill 0.6)
  Top 0.203: v35.04,15.47 35.03,15.49 35.02,16.08 36.15,17.21 36.15,19.1 38.95,21.9 38.95,23.5 39.52,24.06 39.52,24.74 40.72,25.94 40.72,26.9 41.08,27.26 44.07,27.26 v44.09,27.28 | v52.25,29.76 52.92,30.06 55.29,34.06 79.6,34.01 80.35,34.77 80.35,39.55 84.64,43.85 84.65,61.5 86.84,63.69 86.84,66.75 | 86.84,66.75 86.84,66.76 | 86.84,66.75 HT1.MP
  Bottom 0.203: C23.- 36.48,15.31 36.3,15.23 35.28,15.23 v35.04,15.47 | v44.09,27.28 44.62,27.27 47.07,29.79 52.23,29.78 v52.25,29.76
N$64  (via drill 0.6)
  Top 0.203: v22.95,17.65 22.95,10.67 v21.8,9.91
  Bottom 0.203: R19.1 26.65,19.7 26.07,18.7 25.1,18.67 23.71,17.27 23.45,17.27 23.07,17.65 v22.95,17.65 21.57,17.65 21.24,17.32 21.17,17.4 C25.2 | v21.8,9.91 23.07,9.91 24.34,8.64 IC5.3
N$65  (via drill 0.6)
  Top 0.203: v27.26,32.51 v27.27,32.5 27.26,29.08 28.42,27.83 28.41,26.85 28.37,27.87 28.43,26.84 v28.33,25.18 | v88.17,32.72 87.46,33.15 84.22,33.15 82.77,32.05 v81.76,31.62
  Bottom 0.203: IC1.14 93.02,23.88 94.19,23.88 94.56,24.34 94.56,26.46 92.6,28.29 92.62,28.98 89.63,32.02 88.93,32.01 88.08,32.7 v88.17,32.72 | 27.85,21.84 R19.2 27.36,22.07 v28.33,25.18 | v81.76,31.62 81.33,31.94 80.77,32.34 71.09,32.35 70.31,31.85 67.95,31.88 67.54,31.89 67.49,31.89 66.76,33.04 65.38,33.04 51.25,33.05 46.55,33.05 27.82,33.06 v27.26,32.51
N$68  (via drill 0.6)
  Top 0.203: v99.91,61.48 SW4.P$1 | 108.42,58.37 107.67,58.99 105.04,58.99 105.03,59 v103.29,59.34 | v108.8,35.69 109.65,36.42 109.66,37.21 109.67,37.5 109.65,54.36 108.42,58.37 | v99.78,15.24 99.79,16.24 102.98,19.4 102.98,20.33 103.56,20.89 v104.1,21.36 | 108.42,58.37 v108.24,58.37
  Bottom 0.203: C28.1 106.5,58.5 106.62,58.38 v108.24,58.37 | v108.8,35.69 108.04,34.92 108.03,30.07 106.81,28.82 106.81,27.07 105.97,26.18 105.97,23.79 105.91,23.72 105.91,23.69 104.4,22.18 104.4,21.6 104.11,21.31 104.1,21.32 v104.1,21.36 | IC1.26 88.81,14.91 91.4,12.32 94.67,12.32 97.33,15 99.53,14.99 v99.78,15.24 | v99.91,61.48 100.2,61.72 101.86,60.63 102.52,59.87 103.03,59.48 103.21,59.25 v103.29,59.34
N$71  (via drill 0.6)
  Top 0.203: SW1.P$1 24.59,25.92 v23.73,25.38 23.73,27.31 25.55,29.97 v25.54,33.53 | v91.4,19.56 90.05,20.75 90.05,22.58 89.08,23.31 89.08,25.66 86.83,27.94 85.68,29.08 84.93,29.08 82.76,29.08 82.36,28.63 81.44,28.63 80.73,29.39 80.73,32.24 82.45,33.85 82.45,34.42 v82.95,34.8
  Bottom 0.203: C31.1 25.61,26.65 24.66,25.92 v23.73,25.38 | IC1.22 92.94,17.53 91.91,17.53 91.91,19.05 v91.4,19.56 | v25.54,33.53 25.99,34.02 70.32,34.04 70.82,33.53 81.56,33.53 v82.95,34.8
N$72  (via drill 0.6)
  Top 0.203: SW2.P$1 65.25,26.53 65.27,26.54 67.2,26.54 v69.4,23.7 | v78.24,23.5 81.99,19.73 83.78,17.97 83.78,12.83 93.3,3.17 98,3.17 99.91,5.46 v99.91,9.14 | v96.61,10.67 94.95,10.67 93.56,12.06 93.05,12.06 91.78,13.34 v91.78,13.84
  Bottom 0.203: 90.38,15.64 IC1.24 90.38,15.69 90.38,14.6 91.14,13.84 v91.78,13.84 | v99.91,9.14 98.38,10.67 v96.61,10.67 97,10.67 C30.1 | v69.4,23.7 70.04,23.29 77.66,23.27 v78.24,23.5
N$73  (via drill 0.6)
  Top 0.203: SW3.P$1 95.72,26.54 | SW3.P$1 | SW3.P$1 96.18,26.16 96.18,17.15 v95.72,16.76
  Bottom 0.203: C29.1 95.73,16.65 v95.72,16.76 94.74,15.66 IC1.23
VCC  (via drill 0.51, 0.6)
  Top 0.203: 28.79,12.95 v28.79,12.57
  Top 0.406: 59.52,16.38 LED7.A | 59.52,16.38 59.14,16.76 52.79,16.76 49.03,20.53 LED2.A 48.41,25.09 47.31,26.31 47.32,27.42 47.33,27.76 46.63,28.44 40.63,28.43 40.09,27.77 40.09,26.12 38.99,25.02 38.31,25.02 | 38.31,25.02 38.29,25.04 LED6.A 38.31,25.08 38.31,25.02 | LED10.A 24.77,3.25 24.72,3.3 24.86,3.44 LED5.A | 24.85,14.35 24.86,14.36 LED5.A | LED1.A 14.32,24.88 20.15,19.05 22.95,19.05 24.85,17.15 LED5.A | LED5.A 26.34,12.95 28.79,12.95 29.17,12.95 38.31,22.06 38.31,25.02 | 59.52,16.38 59.52,18.54 v61.3,20.32 | v72.98,19.61 72.98,25.07 72.96,25.09 LED8.A 74.76,26.9 v74.76,27.61 | LED3.A 82,26.86 v82,26.92 | LED9.A 104.21,25.13 v103.97,24.89 103.95,24.86 103.92,24.89 102.14,24.89 101.44,24.14 101.44,21 101.04,20.55 101.01,20.55 97,16.55 96.99,16.55 96.65,16.16 94.87,14.44 94.86,14.72 94.18,14.27 LED4.A | v99.4,37.34 102.96,40.89 v102.96,49.28
  Top 0.813: v82,26.92 81.87,27.05 80.74,27.38 79.4,28.96 79.37,32.75 81.18,34.42 81.19,39.13 v89.77,47.76 | v102.96,49.28 102.95,56.93 101.88,58.16 91,58.14 v89.86,57.44
  Bottom 0.203: 103.73,33.71 103.67,33.71 C5.2 | IC5.6 24.34,13.79 24.94,14.38 28.47,14.38 | 28.47,14.38 29.15,15.06 29.15,15.97 29.18,16 | 29.18,16 29.21,16.03 | 29.18,16 C24.+ | v28.79,12.57 28.79,13.84 28.47,14.38
  Bottom 0.406: v72.98,19.61 70.05,19.59 68.92,20.32 v61.3,20.32 | v82,26.92 81.35,27.62 v74.76,27.61 | v103.97,24.89 103.84,25.15 103.84,26.54 C21.2 103.72,26.91 103.72,30.86 103.34,31.24 | IC4.1 102.54,31.24 103.34,31.24 | 103.59,33.91 C5.2 103.48,33.8 103.46,33.78 102.94,33.76 102.33,34.36 102.35,35.12 101.67,35.68 100.57,35.73 100.54,35.76 C4.1 | 103.34,31.24 103.65,31.59 103.73,31.67 103.73,33.71 | C4.1 100.54,35.69 | C4.1 100.54,36.19 v99.4,37.34 | IC2.16 101.76,47.66 101.76,48.58 102.42,49.24 102.94,49.24 102.94,49.26 v102.96,49.28 | 89.86,57.51 89.65,57.22 v89.86,57.44
  Bottom 0.813: v89.77,47.76 89.84,49.24 L2.P$4 89.87,50.82 89.88,50.95 | C19.+ 92.98,63.7 91.5,61.81 91.51,59.49 89.78,57.38 | 89.78,57.38 89.72,57.34 | 88.68,63.78 88.68,63.88 | 88.68,63.78 ANODE.MP | 88.68,63.78 88.69,62.82 89.85,62.08 89.85,62.06 89.86,57.51 88.25,55.84 86.44,55.86 IC3.3 | C18.2 85.94,49.52 86.19,49.76 86.3,49.65 87.74,49.65 88.41,50.33 89.11,50.33 89.88,50.95 | 89.88,50.95 89.88,53.24 89.87,53.31 89.88,54.89 v89.86,57.44 89.84,57.44 89.78,57.37 89.78,57.38

### Text on the board
Documentation: Cut out area
tPlace: LBM elektronik
tNames: Part # 1000 0007
Document: View area
lcd: LCD